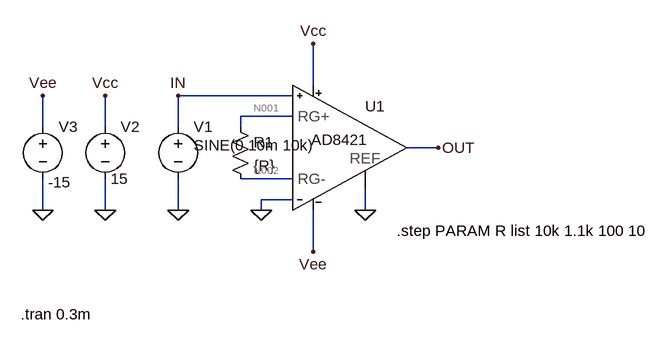
[diagram p0: schematic AD8421_test.asc]
AD8421_test.asc, the LTspice schematic file:
Version 4
SHEET 1 880 680
WIRE 128 16 128 -48
WIRE 96 32 -80 32
WIRE 96 64 16 64
WIRE -288 80 -288 32
WIRE -192 80 -192 32
WIRE -80 80 -80 32
WIRE 16 80 16 64
WIRE 320 112 272 112
WIRE 96 160 16 160
WIRE 96 192 48 192
WIRE -288 208 -288 160
WIRE -192 208 -192 160
WIRE -80 208 -80 160
WIRE 48 208 48 192
WIRE 208 208 208 176
WIRE 128 272 128 208
FLAG -80 208 0
FLAG 48 208 0
FLAG 208 208 0
FLAG -192 208 0
FLAG -288 208 0
FLAG 128 -48 Vcc
FLAG -192 32 Vcc
FLAG 128 272 Vee
FLAG -288 32 Vee
FLAG 320 112 OUT
FLAG -80 32 IN
SYMBOL res 0 64 R0
SYMATTR InstName R1
SYMATTR Value {R}
SYMBOL voltage -80 64 R0
WINDOW 3 24 44 Left 2
WINDOW 39 0 0 Left 2
SYMATTR Value SINE(0 10m 10k)
SYMATTR Value2 AC 1
SYMATTR InstName V1
SYMBOL voltage -192 64 R0
WINDOW 3 8 96 Left 2
WINDOW 123 0 0 Left 2
WINDOW 39 0 0 Left 2
SYMATTR Value 15
SYMATTR InstName V2
SYMBOL voltage -288 64 R0
WINDOW 3 8 101 Left 2
WINDOW 123 0 0 Left 2
WINDOW 39 0 0 Left 2
SYMATTR Value -15
SYMATTR InstName V3
SYMBOL MyLibrary\\ad8421\\AD8421 128 112 R0
SYMATTR InstName U1
TEXT 256 240 Left 2 !.step PARAM R list 10k 1.1k 100 10
TEXT -322 368 Left 2 !.tran 0.3m

The netlist it stands for:
* AD8421_test.asc
R1 N001 N002 {R}
V1 IN 0 SINE(0 10m 10k) AC 1
V2 Vcc 0 15
V3 Vee 0 -15
XU1 IN N001 N002 0 0 Vee OUT Vcc AD8421  ; pins IN- RG- RG+ IN+ -Vs REF Vout +Vs
.step PARAM R list 10k 1.1k 100 10
.tran 0.3m
.lib AD8421.CIR
.backanno
.end

* Results of the author's LTspice run, read from the files saved beside the schematic
* Operating Point (first step), zero values left out:
*   r = 10 k
*   V(n001) = 1.333 V
*   V(n002) = 1.333 V
*   V(vcc) = 15 V
*   V(vee) = -15 V
*   V(out) = 1.106 V
*   I(R1) = -74.18 pA
*   I(V3) = 13.87 TA
*   I(V2) = -1.94 mA
*   I(V1) = 1.748 nA
*   Ix(u1:IN-) = -1.748 nA
*   Ix(u1:RG-) = 74.18 pA
*   Ix(u1:RG+) = -74.18 pA
*   Ix(u1:IN+) = 252.5 pA
*   Ix(u1:-VS) = -1.975 mA
*   Ix(u1:REF) = -13.87 TA
*   Ix(u1:+VS) = 1.94 mA
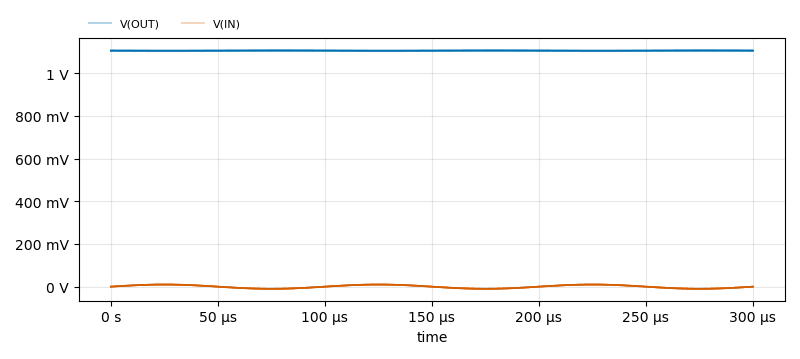
[diagram p1: Transient Analysis of AD8421_test.asc, plotted from the saved traces]
* Transient Analysis, 7 runs:
*   V(OUT) [run 1]: min 1.106 V, max 1.106 V, average 1.106 V, rms 1.106 V, last 1.106 V
*   V(OUT) [run 2]: 1.106 V at time=0 s, 1.106 V at time=0 s, min 1.106 V, max 1.106 V
*   V(OUT) [run 3]: min 1.106 V, max 1.106 V, average 1.106 V, rms 1.106 V, last 1.106 V
*   V(OUT) [run 4]: 1.106 V at time=0 s, 1.106 V at time=0 s, min 1.106 V, max 1.106 V
*   V(OUT) [run 5]: min 1.106 V, max 1.106 V, average 1.106 V, rms 1.106 V, last 1.106 V
*   V(OUT) [run 6]: 1.106 V at time=0 s, 1.106 V at time=0 s, min 1.106 V, max 1.106 V
*   V(OUT) [run 7]: min 1.105 V, max 1.107 V, average 1.106 V, rms 1.106 V, last 1.106 V
*   V(IN) [run 1]: min -9.99 mV, max 9.981 mV, average -334.6 nV, rms 7.085 mV, last 0 V
*   V(IN) [run 2]: 0 V at time=0 s, 0 V at time=0 s, min 0 V, max 0 V
*   V(IN) [run 3]: min -9.993 mV, max 9.99 mV, average -257.8 nV, rms 7.086 mV, last 0 V
*   V(IN) [run 4]: 0 V at time=0 s, 0 V at time=0 s, min 0 V, max 0 V
*   V(IN) [run 5]: min -9.999 mV, max 9.999 mV, average 12.14 nV, rms 7.081 mV, last 0 V
*   V(IN) [run 6]: 0 V at time=0 s, 0 V at time=0 s, min 0 V, max 0 V
*   V(IN) [run 7]: min -9.998 mV, max 9.993 mV, average -90.02 nV, rms 7.073 mV, last 0 V